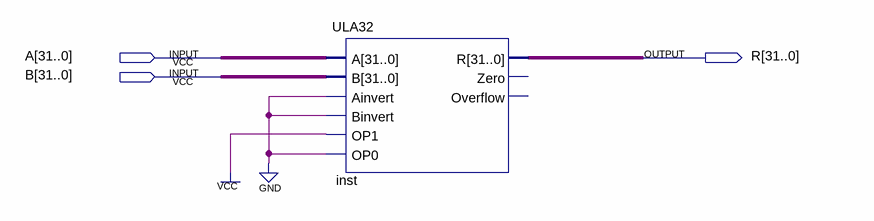
[diagram p0: schematic sheet]
// Quartus schematic Adder32.bdf as structural Verilog: 1 symbols, 3 pins
module Adder32 (
  input  [31:0] A,
  input  [31:0] B,
  output [31:0] R
);

  ULA32 inst (.A(A), .B(B), .Ainvert(1'b0), .Binvert(1'b0), .OP1(1'b1), .OP0(1'b0), .R(R));  // open: Zero, Overflow
endmodule
